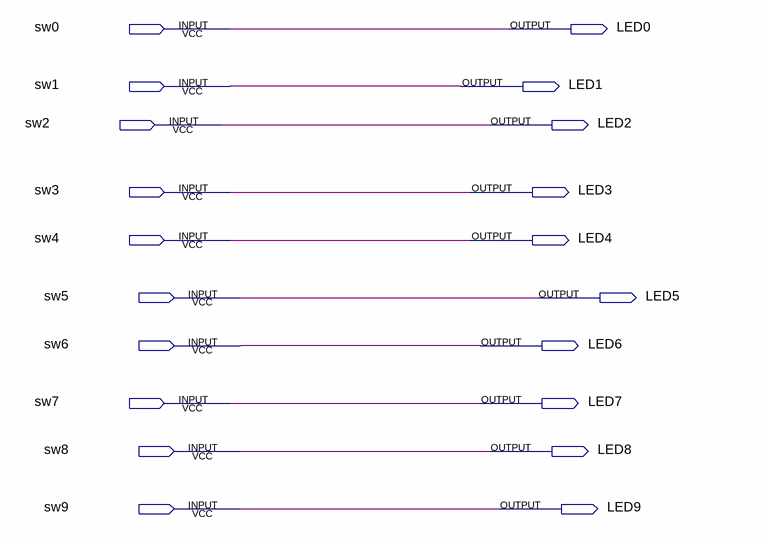
[diagram p0: schematic sheet]
// Quartus schematic glue_logic.bdf as structural Verilog: 0 symbols, 20 pins
module glue_logic (
  input  sw0,
  input  sw1,
  input  sw2,
  input  sw3,
  input  sw4,
  input  sw5,
  input  sw6,
  input  sw7,
  input  sw8,
  input  sw9,
  output LED0,
  output LED1,
  output LED2,
  output LED3,
  output LED4,
  output LED5,
  output LED6,
  output LED7,
  output LED8,
  output LED9
);


  assign LED0 = sw0;
  assign LED1 = sw1;
  assign LED2 = sw2;
  assign LED3 = sw3;
  assign LED4 = sw4;
  assign LED5 = sw5;
  assign LED6 = sw6;
  assign LED7 = sw7;
  assign LED8 = sw8;
  assign LED9 = sw9;
endmodule
